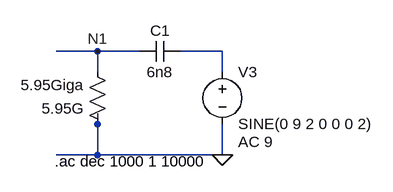
[diagram p0: schematic Draft1.asc]
Draft1.asc, the LTspice schematic file:
Version 4
SHEET 1 880 680
WIRE 64 80 0 80
WIRE 128 80 64 80
WIRE 256 80 192 80
WIRE 64 112 64 80
WIRE 256 112 256 80
WIRE 64 192 64 176
WIRE 64 240 64 192
WIRE 64 240 0 240
WIRE 256 240 256 192
WIRE 256 240 64 240
FLAG 256 240 0
FLAG 64 80 N1
SYMBOL res 80 208 R180
WINDOW 0 36 76 Left 2
WINDOW 3 36 40 Left 2
SYMATTR InstName 5.95Giga
SYMATTR Value 5.95G
SYMBOL cap 128 96 R270
WINDOW 0 32 32 VTop 2
WINDOW 3 0 32 VBottom 2
SYMATTR InstName C1
SYMATTR Value 6n8
SYMBOL voltage 256 96 R0
WINDOW 123 24 124 Left 2
WINDOW 39 0 0 Left 0
SYMATTR InstName V3
SYMATTR Value SINE(0 9 2 0 0 0 2)
SYMATTR Value2 AC 9
TEXT -2 250 Left 2 !.ac dec 1000 1 10000

The netlist it stands for:
* Draft1.asc
R§5.95Giga 0 N1 5.95G
C1 N1 N001 6n8
V3 N001 0 SINE(0 9 2 0 0 0 2) AC 9
.ac dec 1000 1 10000
.backanno
.end